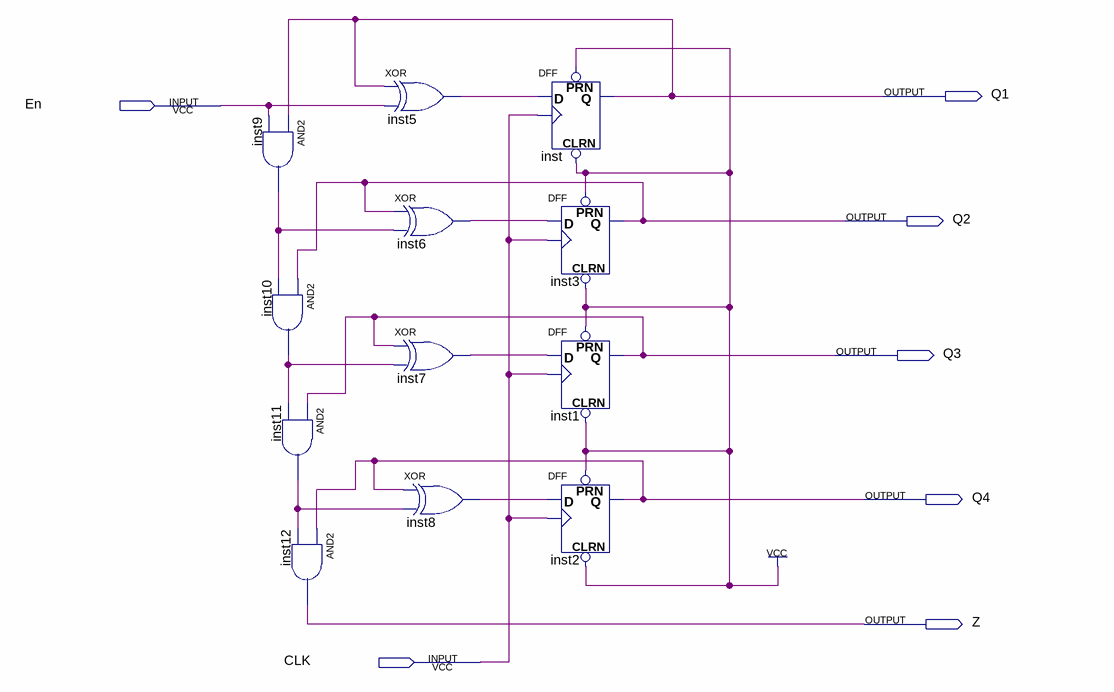
[diagram p0: schematic sheet]
// Quartus schematic lab10step2.bdf as structural Verilog: 12 symbols, 7 pins
module lab10step2 (
  input  En,
  input  CLK,
  output Q1,
  output Q2,
  output Q3,
  output Q4,
  output Z
);

  wire inst5_out, inst6_out, inst7_out, inst8_out, inst9_out, inst10_out, inst11_out;

  and inst9 (inst9_out, Q1, En);
  and inst10 (inst10_out, Q2, inst9_out);
  and inst11 (inst11_out, Q3, inst10_out);
  and inst12 (Z, Q4, inst11_out);
  xor inst5 (inst5_out, Q1, En);
  xor inst6 (inst6_out, Q2, inst9_out);
  xor inst7 (inst7_out, Q3, inst10_out);
  xor inst8 (inst8_out, Q4, inst11_out);
  DFF inst (.CLRN(1'b1), .CLK(CLK), .D(inst5_out), .PRN(1'b1), .Q(Q1));
  DFF inst3 (.CLRN(1'b1), .CLK(CLK), .D(inst6_out), .PRN(1'b1), .Q(Q2));
  DFF inst1 (.CLRN(1'b1), .CLK(CLK), .D(inst7_out), .PRN(1'b1), .Q(Q3));
  DFF inst2 (.CLRN(1'b1), .CLK(CLK), .D(inst8_out), .PRN(1'b1), .Q(Q4));
endmodule
